# EAGLE design leds (EAGLE 7.2.0)
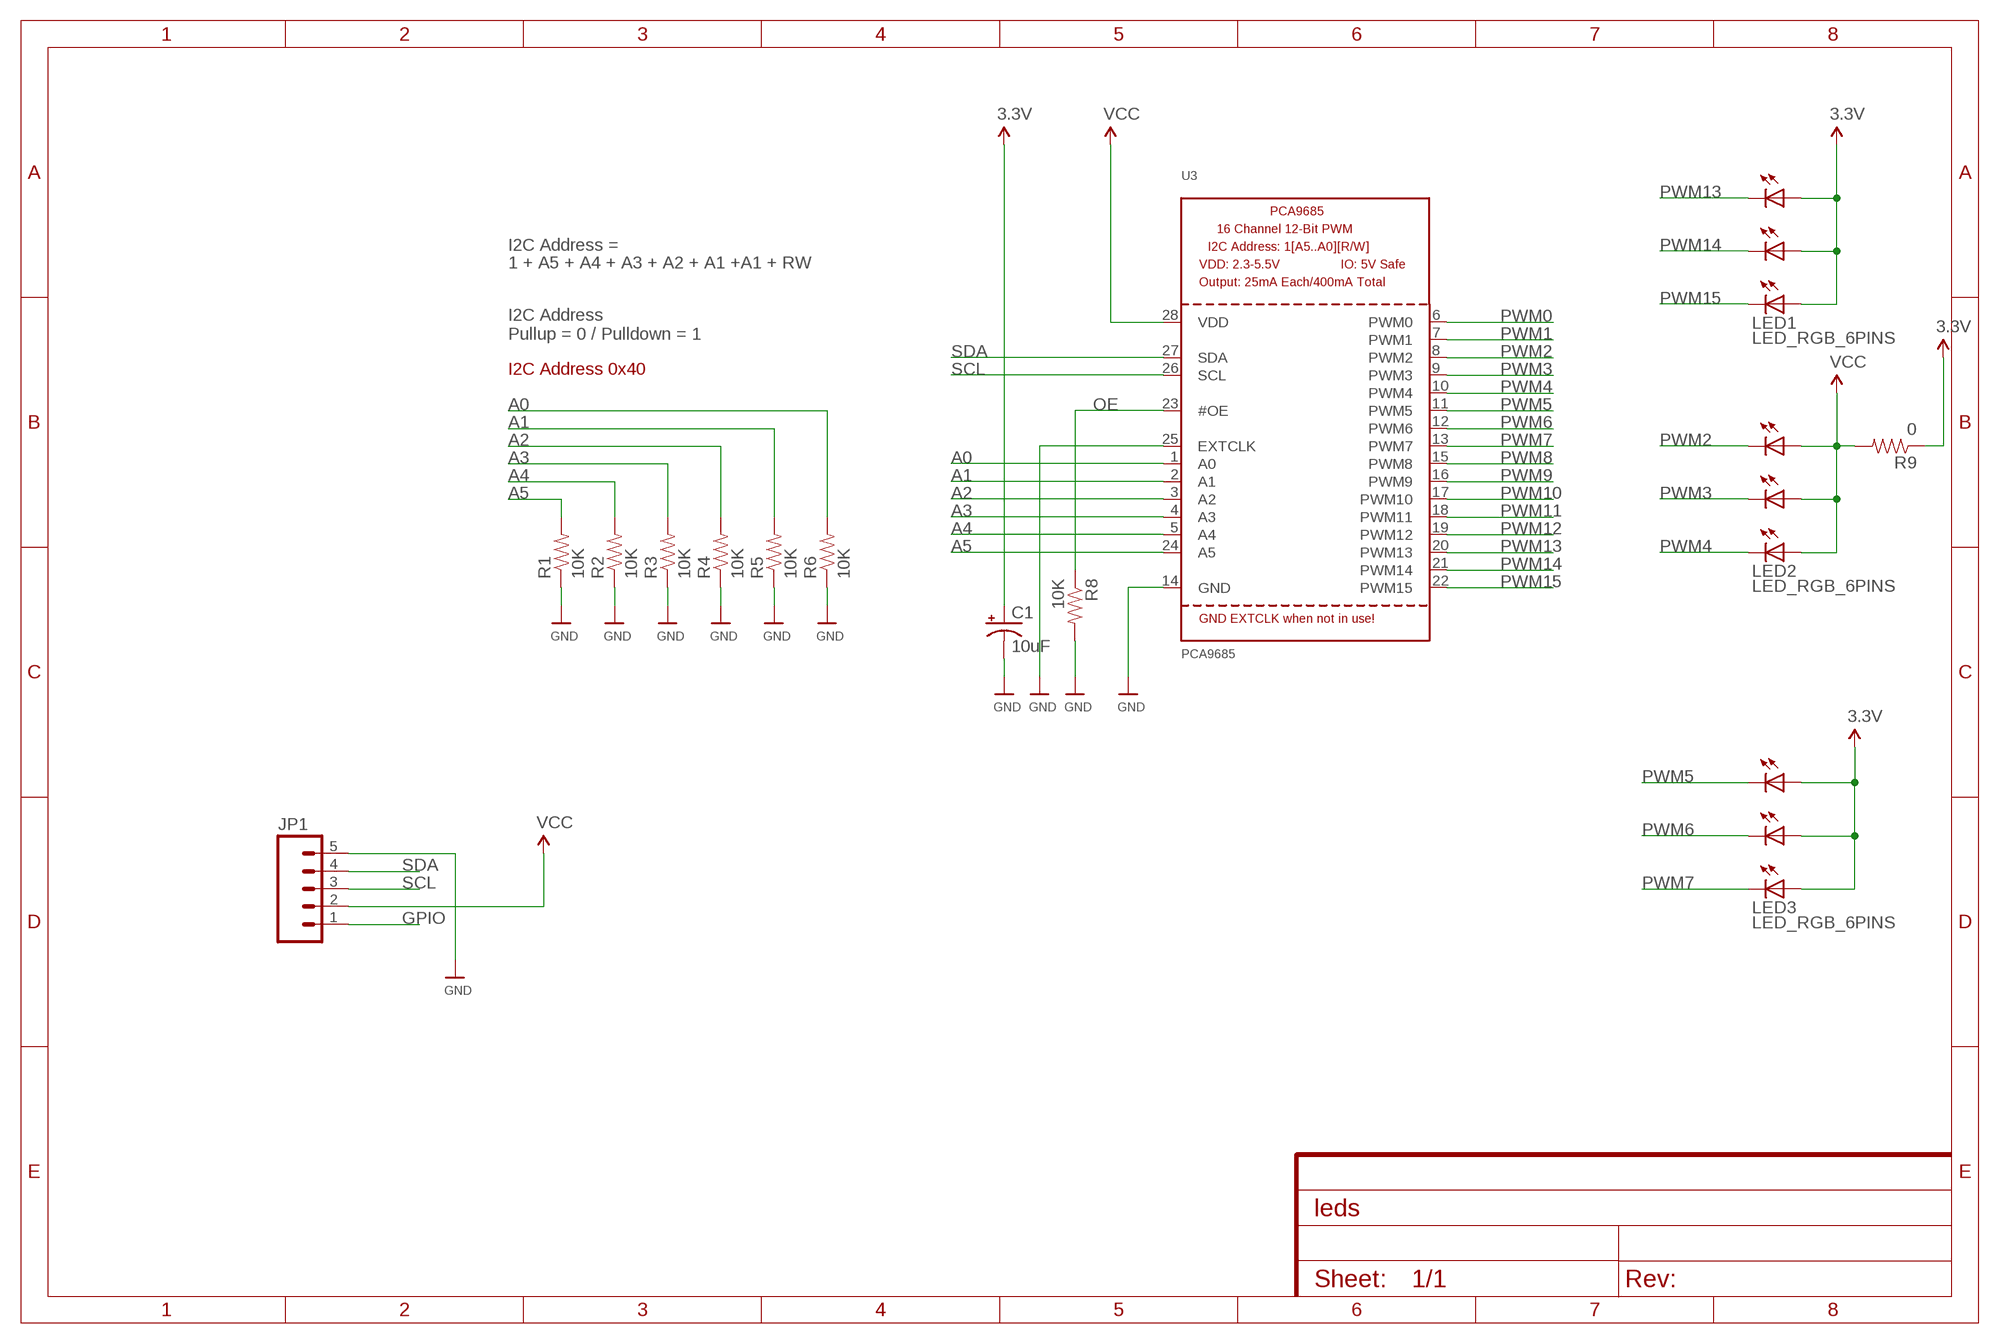
[diagram p0: schematic, sheet 1]

## Parts
C1  10uF  CAP_POL1206  [EIA3216]
JP1  M05PTH  [1X05]
LED1  LED_RGB_6PINS  [LED_RGB_6PINS]
LED2  LED_RGB_6PINS  [LED_RGB_6PINS]
LED3  LED_RGB_6PINS  [LED_RGB_6PINS]
R1  10K  RESISTOR1206  [1206]
R2  10K  RESISTOR1206  [1206]
R3  10K  RESISTOR1206  [1206]
R4  10K  RESISTOR1206  [1206]
R5  10K  RESISTOR1206  [1206]
R6  10K  RESISTOR1206  [1206]
R8  10K  RESISTOR1206  [1206]
R9  0  RESISTOR2512  [R2512]
U3  PCA9685  [TSSOP28]

## Nets
3.3V: C1.A(+) LED1.BA LED1.GA LED1.RA LED3.BA LED3.GA LED3.RA R9.1
A0: R6.2 U3.1(A0)
A1: R5.2 U3.2(A1)
A2: R4.2 U3.3(A2)
A3: R3.2 U3.4(A3)
A4: R2.2 U3.5(A4)
A5: R1.2 U3.24(A5)
GND: C1.C(-) JP1.5 R1.1 R2.1 R3.1 R4.1 R5.1 R6.1 R8.2 U3.14(GND) U3.25(EXTCLK)
GPIO: JP1.1
OE: R8.1 U3.23(#OE)
PWM0: U3.6(PWM0)
PWM1: U3.7(PWM1)
PWM2: LED2.BC U3.8(PWM2)
PWM3: LED2.RC U3.9(PWM3)
PWM4: LED2.GC U3.10(PWM4)
PWM5: LED3.BC U3.11(PWM5)
PWM6: LED3.RC U3.12(PWM6)
PWM7: LED3.GC U3.13(PWM7)
PWM8: U3.15(PWM8)
PWM9: U3.16(PWM9)
PWM10: U3.17(PWM10)
PWM11: U3.18(PWM11)
PWM12: U3.19(PWM12)
PWM13: LED1.BC U3.20(PWM13)
PWM14: LED1.RC U3.21(PWM14)
PWM15: LED1.GC U3.22(PWM15)
SCL: JP1.3 U3.26(SCL)
SDA: JP1.4 U3.27(SDA)
VCC: JP1.2 LED2.BA LED2.GA LED2.RA R9.2 U3.28(VDD)

## Notes on the sheet
- I2C Address =
- 1 + A5 + A4 + A3 + A2 + A1 +A1 + RW
- I2C Address
  Pullup = 0 / Pulldown = 1
- I2C Address 0x40

## Library data of the parts
C1 = SparkFun-Passives:CAP_POL: Capacitor Polarized These are standard SMD and PTH capacitors. Normally 10uF, 47uF, and 100uF in electrolytic and tantalum varieties. Always verify the external diameter of the through hole cap, it varies with capacity, voltage, and manufacturer. The EIA devices should be standard.
JP1 = SparkFun-Connectors:M05: Header 5 Standard 5-pin 0.1" header. Use with straight break away headers (SKU : PRT-00116), right angle break away headers (PRT-00553), swiss pins (PRT-00743), machine pins (PRT-00117), and female headers (PRT-00115). Molex polarized connector foot print use with SKU : PRT-08230 with associated crimp pins and housings.
LED1-LED3 = Mlab_ProEx2015:LED_RGB_6PINS
R1-R6 R8 = SparkFun-Resistors:RESISTOR: Resistor
R9 = 01_SparkFun:RESISTOR: Resistor
U3 = microbuilder:PCA9685: PCA9685 - 16 Channel 12-Bit I2C PWM Controller 5.0V tolerant 16 channel, 12-bit I2C PWM controller with 25mA per output (max. 400mA total) Digikey: 568-5931-1-ND

## Board
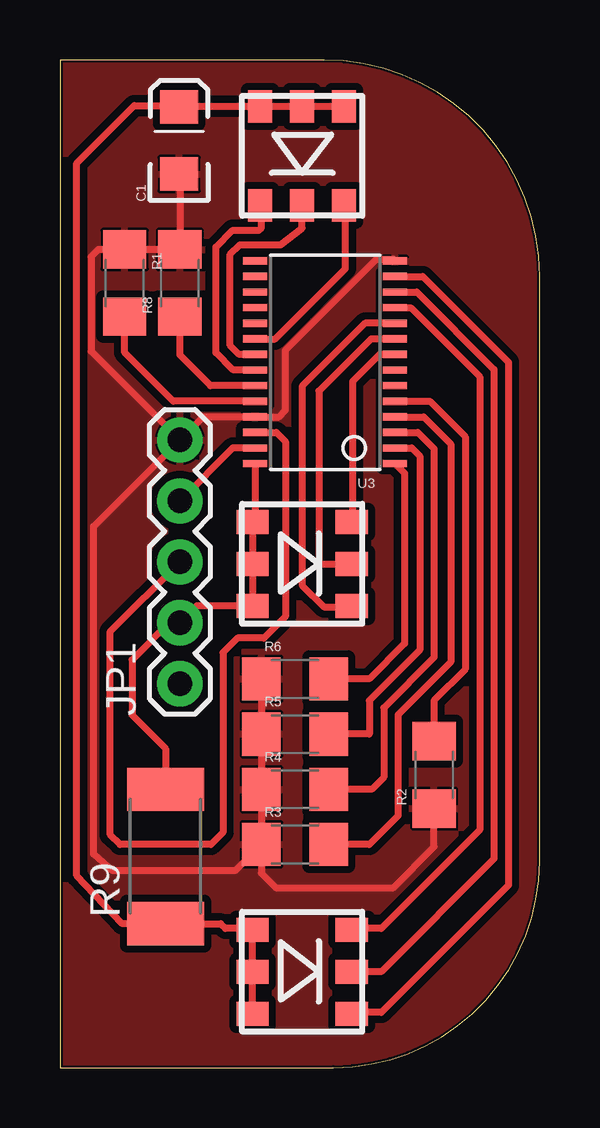
[diagram p1: board, top side]

Size 20 x 42 mm. Coordinates in mm from the lower left corner, seen from the top.
Outline: 0,0 11.4,0 arc90 20,8.6 20,33 arc90 11,42 0,42 0,0
Copper layers (1*16): Top 0.035mm / dielectric 1.5mm / Bottom 0.035mm
Design rules "mdx40_0mm3_v2 *": minimum track width 0.2mm, minimum drill 0.6mm, track to track 0.3mm, track to pad 0.3mm, pad to pad 0.3mm, via to via 0.3mm, smd to smd 0.3mm, copper to edge 0.1mm, drill to drill 0.5mm, minimum pad ring 12mil, minimum via ring 10mil, stop-mask expansion 4mil, vias tented up to drill 25mil, thermal gap 0.1mm

### Footprints (pad centres in the part's own frame; a part is rotated, then mirrored left to right if it is on the bottom)
EIA3216 = smd 1.4 x 1.6: A 1.4,0; C -1.4,0
1X05 = drill 1.016 pad 1.88: 1 0,0; 2 2.54,0; 3 5.08,0; 4 7.62,0; 5 10.16,0
LED_RGB_6PINS = smd 1 x 1.35: BA -1.749,-2.07; BC -1.749,2.07; GA 1.751,-2.07; GC 1.751,2.07; RA 0.001,-2.07; RC 0.001,2.07
1206 = smd 1.6 x 1.8: 1 -1.4,0; 2 1.4,0
R2512 = smd 1.8 x 3.2: 1 -2.8,0; 2 2.8,0
TSSOP28 = smd 0.305 x 0.991: 1 -4.225,-2.918; 2 -3.575,-2.918; 3 -2.925,-2.918; 4 -2.275,-2.918; 5 -1.625,-2.918; 6 -0.975,-2.918; 7 -0.325,-2.918; 8 0.325,-2.918; 9 0.975,-2.918; 10 1.625,-2.918; 11 2.275,-2.918; 12 2.925,-2.918; 13 3.575,-2.918; 14 4.225,-2.918; 15 4.225,2.918; 16 3.575,2.918; 17 2.925,2.918; 18 2.275,2.918; 19 1.625,2.918; 20 0.975,2.918; 21 0.325,2.918; 22 -0.325,2.918; 23 -0.975,2.918; 24 -1.625,2.918; 25 -2.275,2.918; 26 -2.925,2.918; 27 -3.575,2.918; 28 -4.225,2.918

### Placement (x,y rotation side)
C1  4.97,38.65 90 top
JP1  5,16 90 top
LED1  10.1,38 180 top
LED2  10.1,21 270 top
LED3  10.1,4 270 top
R1  2.7,32.7 270 top
R2  15.6,12.2 90 top
R3  9.8,9.3 0 top
R4  9.8,11.6 0 top
R5  9.8,13.9 0 top
R6  9.8,16.2 0 top
R8  5,32.7 90 top
R9  4.4,8.8 90 top
U3  11.05,29.4 90 top

### Tracks (layer width: path | path; a pad name or v marks a point on that pad's centre or on a via)
3.3V
  Top 0.3: LED3.GA LED3.RA LED3.BA | 7.98,5.8 6.9,5.8 6.7,6 R9.1 2.6,6 0.7,8 0.7,37.7 3.1,40.1 4.92,40.1 C1.A | 5,40.07 LED1.GA LED1.RA LED1.BA
  Top 0.406: 7.98,5.8 LED3.BA | 5,40.07 C1.A
A0
  Top 0.3: R6.2 12.9,16.2 14.37,17.67 14.37,24.77 U3.1
A1
  Top 0.3: U3.2 14.68,25.82 15,25.5 15,17.4 12.9,15.3 12.9,13.9 R5.2
  Top 0.406: 11.3,14 R5.2
A2
  Top 0.3: U3.3 14.93,26.48 15.6,25.8 15.6,17.1 13.5,15 13.5,12.1 13,11.6 R4.2
A3
  Top 0.3: U3.4 15.18,27.12 16.3,26 16.3,16.9 14.1,14.7 14.1,10.5 12.9,9.3 R3.2
A4
  Top 0.3: U3.5 15.43,27.77 16.9,26.3 16.9,16.6 15.6,15.3 R2.2
A5
  Top 0.3: U3.24 4.72,27.77 2.7,29.8 R1.2
GND
  Top 0.3: R3.1 8.4,8.1 9,7.5 13.9,7.5 15.6,9.2 R2.1 | U3.14 13.9,33.7 13.2,33.7 9.4,29.9 9.4,27.4 9.12,27.12 U3.25 5.96,27.12 JP1.5 | R6.1 R5.1 R4.1 R3.1 | JP1.5 1.4,22.56 1.4,8.9 2.2,8.2 7.3,8.2 R3.1 | 5,37.22 R8.2 R1.1 1.6,34.1 1.3,33.8 1.3,29.86 JP1.5
  Top 0.406: C1.C 5,37.22
  pour Top: -0.5,42.7 21,42.7 21,-1.1 -0.7,-1.1 -0.7,42.7
OE
  Top 0.3: U3.23 6.28,28.43 5,29.7 R8.1
PWM2
  Top 0.3: U3.8 13.32,29.73 12.2,28.6 12.2,22.78 LED2.BC
PWM3
  Top 0.3: U3.9 12.97,30.38 10.8,28.2 10.8,21 LED2.RC
PWM4
  Top 0.3: U3.10 12.72,31.02 10.1,28.4 10.1,20.1 11,19.2 12.12,19.2 LED2.GC
PWM5
  Top 0.3: U3.11 14.62,31.68 17.5,28.8 17.5,9.9 13.4,5.8 12.22,5.8 LED3.BC
PWM6
  Top 0.3: U3.12 14.88,32.33 18.1,29.1 18.1,8.7 13.4,4 LED3.RC
PWM7
  Top 0.3: U3.13 15.12,32.98 18.7,29.4 18.7,7.6 13.4,2.3 12.22,2.3 LED3.GC
PWM13
  Top 0.3: U3.20 8.97,30.38 11.9,33.3 11.9,35.88 LED1.BC
PWM14
  Top 0.3: U3.21 7.47,29.73 7.1,30.1 7.1,33.9 7.5,34.3 9.2,34.3 10.1,35 LED1.RC
PWM15
  Top 0.3: U3.22 7.22,29.07 6.5,29.8 6.5,34.2 7.2,34.9 8.3,34.9 8.4,35 8.4,35.88 LED1.GC
SCL
  Top 0.3: U3.26 9.03,26.48 9.4,26.1 9.4,18.8 8.5,17.9 7.4,17.9 6.8,17.3 6.8,9.8 6.3,9.3 2.5,9.3 2.1,9.7 2.1,18.18 JP1.3
SDA
  Top 0.3: U3.27 7.21,25.82 JP1.4
VCC
  Top 0.3: U3.28 8.14,22.86 LED2.BA LED2.RA LED2.GA 5.71,19.25 JP1.2 4.54,18.54 3,17 3,14.7 4.4,13.3 R9.2